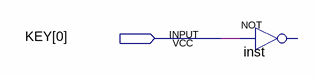
[diagram p0: schematic sheet]
// Quartus schematic button_clock.bdf as structural Verilog: 1 symbols, 1 pins
module button_clock (
  input  [0:0] KEY
);

  // NOT inst has open pins: IN=KEY[0], OUT=open
endmodule
